# Altium schematic sheet Sheet1.SchDoc
size 594 x 420 mm; Address1: Address1; Address2: Address2; Address3: Address3; Address4: Address4; DocumentNumber: АБВГ.123456.001 Э3; SheetNumber: 1; Scale: 1:1; DocumentType: Схема электрическая принципиальная; FirstReferrence: АБВГ.123456.001
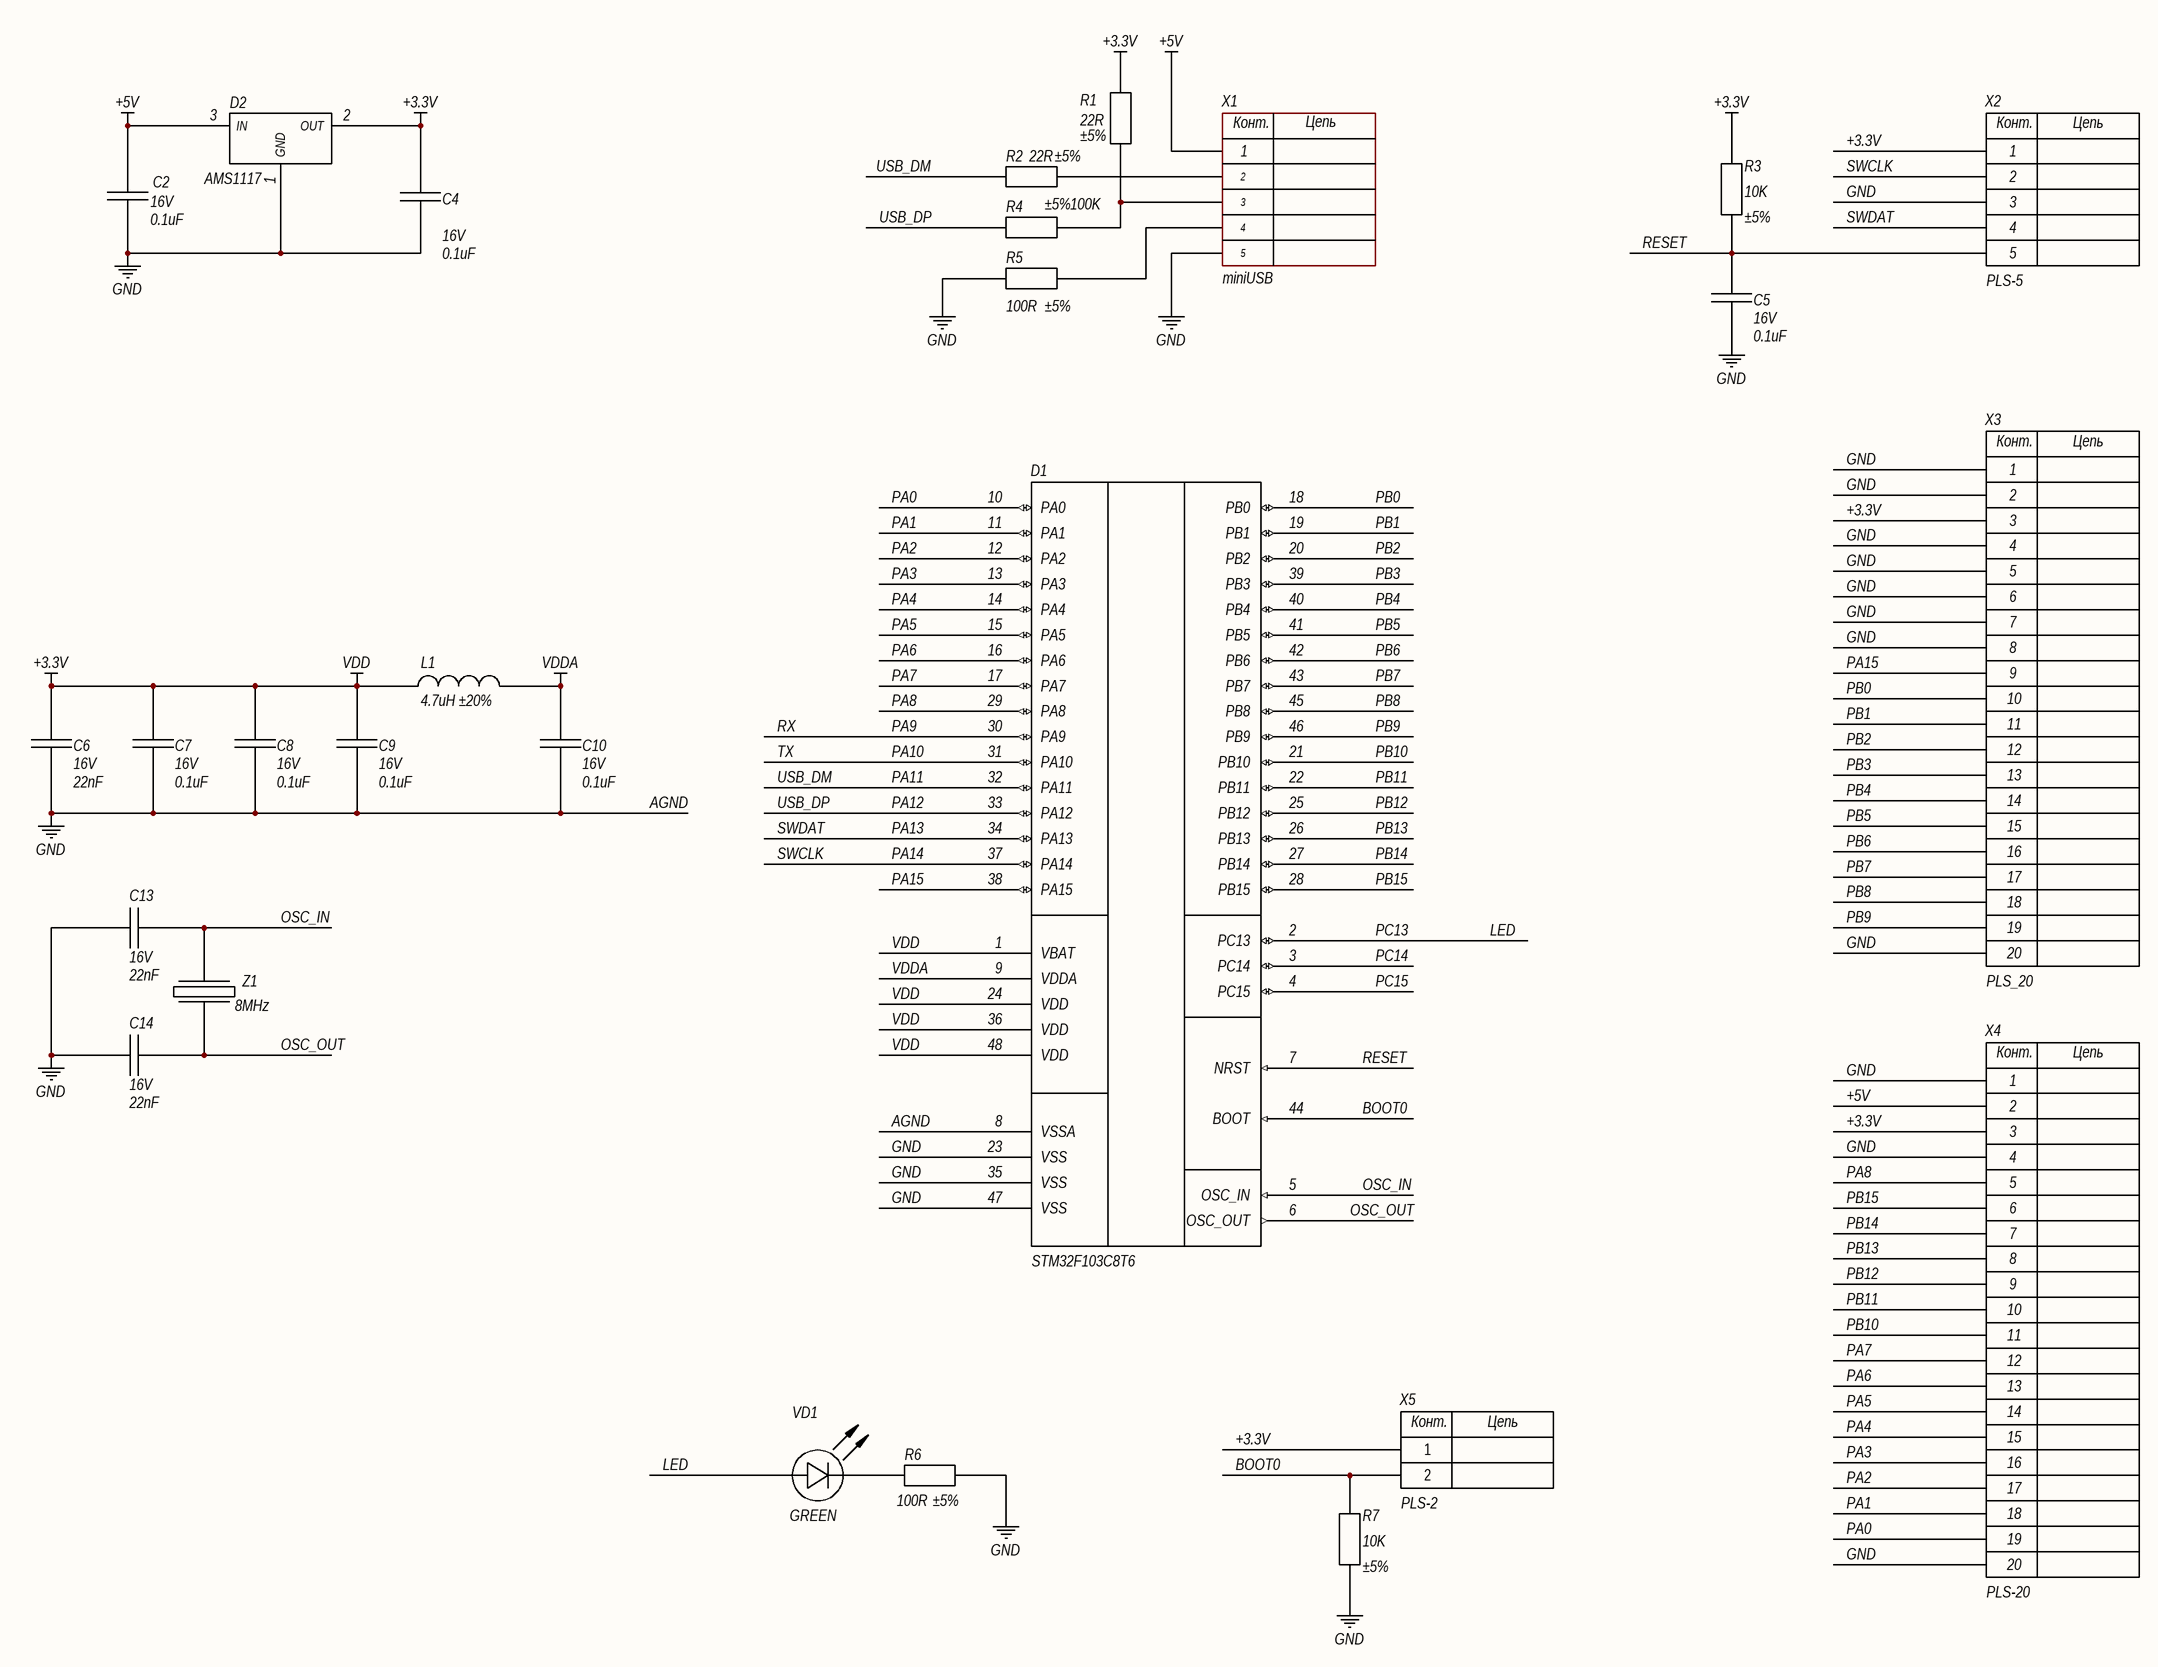
[diagram p0: Sheet1.SchDoc]

## Parts
C2  value 0.1uF  Voltage: 16V  [CAP: 0805]
C4  value 0.1uF  Voltage: 16V  [CAP: 0805]
C5  value 0.1uF  Voltage: 16V  [CAP: 0805]
C6  value 22nF  Voltage: 16V  [CAP: 0805]
C7  value 0.1uF  Voltage: 16V  [CAP: 0805]
C8  value 0.1uF  Voltage: 16V  [CAP: 0805]
C9  value 0.1uF  Voltage: 16V  [CAP: 0805]
C10  value 0.1uF  Voltage: 16V  [CAP: 0805]
C13  value 22nF  Voltage: 16V  [CAP: 0805]
C14  value 22nF  Voltage: 16V  [CAP: 0805]
D1  (no value)  [48-LQFP]
D2  AMS1117  [PCBComponent_1]
L1  value 4.7uH  Tolerance: ±20%  [IND: 0805]
R1  value 22R  Tolerance: ±5%  [RES: 0805]
R2  value 22R  Tolerance: ±5%  [RES: 0805]
R3  value 10K  Tolerance: ±5%  [RES: 0805]
R4  value 100R  Tolerance: ±5%  [RES: 0805]
R5  value 100K  Tolerance: ±5%  [RES: 0805]
R6  value 100R  Tolerance: ±5%  [RES: 0805]
R7  value 10K  Tolerance: ±5%  [RES: 0805]
VD1  Color: GREEN  [LED: 0402B]
X1  CommentText: miniUSB  [CON: 0675031020]
X2  (no value)  [CON: PLS-5]
X3  CommentText: PLS_20  [CON: PLS-20]
X4  (no value)  [CON: PLS-20]
X5  (no value)  [CON: PLS-2]
Z1  Frequency: 8MHz  [OSC: 3215]

## Nets
+3.3V: C4.2 C6.2 C7.2 C8.2 C9.2 D1.1(VBAT) D1.24(VDD) D1.36(VDD) D1.48(VDD) D2.2(OUT) L1.2 R1.1 R3.2 X2.1 X3.3 X4.3 X5.1  [also labelled VDD]
+5V: C2.2 D2.3(IN) X1.1 X4.2
AGND: C2.1 C4.1 C5.1 C6.1 C7.1 C8.1 C9.1 C10.1 C13.2 C14.1 D1.8(VSSA) D1.23(VSS) D1.35(VSS) D1.47(VSS) D2.1(GND) R5.1 R6.2 R7.1 X1.5 X2.3 X3.1 X3.2 X3.4 X3.5 X3.6 X3.7 X3.8 X3.20 X4.1 X4.4 X4.20  [also labelled GND]
VDDA: C10.2 D1.9(VDDA) L1.1
BOOT0: D1.44(BOOT) R7.2 X5.2
LED: D1.2(PC13) VD1.1(A)  [also labelled PC13]
OSC_IN: C13.1 D1.5(OSC_IN) Z1.2
OSC_OUT: C14.2 D1.6(OSC_OUT) Z1.1
PA0: D1.10(PA0) X4.19
PA1: D1.11(PA1) X4.18
PA2: D1.12(PA2) X4.17
PA3: D1.13(PA3) X4.16
PA4: D1.14(PA4) X4.15
PA5: D1.15(PA5) X4.14
PA6: D1.16(PA6) X4.13
PA7: D1.17(PA7) X4.12
PA8: D1.29(PA8) X4.5
PA9: D1.30(PA9)  [also labelled RX]
PA10: D1.31(PA10)  [also labelled TX]
PA11: D1.32(PA11) R2.1  [also labelled USB_DM]
PA12: D1.33(PA12) R4.1  [also labelled USB_DP]
PA13: D1.34(PA13) X2.4  [also labelled SWDAT]
PA14: D1.37(PA14) X2.2  [also labelled SWCLK]
PA15: D1.38(PA15) X3.9
PB0: D1.18(PB0) X3.10
PB1: D1.19(PB1) X3.11
PB2: D1.20(PB2) X3.12
PB3: D1.39(PB3) X3.13
PB4: D1.40(PB4) X3.14
PB5: D1.41(PB5) X3.15
PB6: D1.42(PB6) X3.16
PB7: D1.43(PB7) X3.17
PB8: D1.45(PB8) X3.18
PB9: D1.46(PB9) X3.19
PB10: D1.21(PB10) X4.11
PB11: D1.22(PB11) X4.10
PB12: D1.25(PB12) X4.9
PB13: D1.26(PB13) X4.8
PB14: D1.27(PB14) X4.7
PB15: D1.28(PB15) X4.6
PC14: D1.3(PC14)
PC15: D1.4(PC15)
RESET: C5.2 D1.7(NRST) R3.1 X2.5
NetR1_2: R1.2 R4.2 X1.3
NetR2_2: R2.2 X1.2
NetR5_2: R5.2 X1.4
NetR6_1: R6.1 VD1.2(C)

## Notes on the sheet
- Перв. примен.
- Справ. №
- Подп. и дата
- Инв. № дубл.
- Взам. инв. №
- Разраб.
- Изм.
- Лист
- № докум.
- Подп.
- Дата
- Лит.
- Масса
- Масштаб
- Пров.
- Т.контр.
- Листов
- Инв. № подл.
- Утв.
- Н.контр.
- 2.106-A2
- Копировал
- Формат А2
- (in symbol Connector_USB_mini_B) Конт.; Цепь
- (in symbol PLS-2) Конт.; Цепь
- (in symbol PLS-5) Конт.; Цепь
- (in symbol PLS-20) Конт.; Цепь

## Library data of the parts
C2 C4 C5 C7-C10 = Ceramic_0805: Manufacturer: Yageo; PartNumber: CC0805KRX7R7BB104; ValueManufacturerPartNumber: Ceramic capacitor, 0.1uF, X7R, ±10%, 16V, 0805, -55...+125°C; TypeCapacitor: Ceramic capacitor; Tolerance: ±10%; TypeDielectric: X7R; Package: 0805; HelpURL: https://www.digikey.com/product-detail/en/yageo/CC0805KRX7R7BB104/311-1142-1-ND/303052; Temperature: -55...+125°C
C6 C13 C14 = Ceramic_0805: Manufacturer: Yageo; PartNumber: CC0805KRX7R7BB104; ValueManufacturerPartNumber: Ceramic capacitor, 22nF, X7R, ±10%, 16V, 0805, -55...+125°C; TypeCapacitor: Ceramic capacitor; Tolerance: ±10%; TypeDielectric: X7R; Package: 0805; HelpURL: https://www.digikey.com/product-detail/en/yageo/CC0805KRX7R7BB104/311-1142-1-ND/303052; Temperature: -55...+125°C
D1 = STM32F103C8T6: Cortex-M3; Manufacturer: STMicroelectronics; ValueManufacturerPartNumber: IC microcontroller, 32-Bit, Cortex-M3, 72MHz, 64KB, 20KB, 2...3.6V, -40...+85°C, 48-LQFP; Supply: 2...3.6V; Speed: 72MHz; CoreSize: 32-Bit; MemoryROM: 64KB; MemoryRAM: 20KB; HelpURL: https://www.digikey.com/product-detail/en/stmicroelectronics/STM32F103C8T6TR/497-17666-1-ND/7804402; Package: 48-LQFP; ComponentType: IC microcontroller; Temperature: -40...+85°C; CoreProcessor: Cortex-M3; PartNumber: STM32F103C8T6
L1 = Inductor_0805: Manufacturer: Murata Electronics; PartNumber: LQM21FN100M70L; ValueManufacturerPartNumber: Fixed inductor, 4.7uH, ±20%, 0805, 100mA, -55...+125°C; TypeInductor: Fixed inductor; MaxCurrent: 100mA; Package: 0805; HelpURL: https://www.digikey.com/product-detail/en/murata-electronics-north-america/LQM21FN100M70L/490-4029-1-ND/1016289; Temperature: -55...+125°C
R1 R2 = Resistor_0805: Manufacturer: Yageo; PartNumber: RC0805JR-07100RL; ValueManufacturerPartNumber: Resistor film, 22R, ±5%, 0805, 0.125W, -55...+125°C; TypeResistor: Resistor film; Power: 0.125W; Package: 0805; HelpURL: https://www.digikey.com/product-detail/en/yageo/RC0805JR-07100RL/311-100ARCT-ND/731185; Temperature: -55...+125°C
R3 R7 = Resistor_0805: Manufacturer: Yageo; PartNumber: RC0805JR-07100RL; ValueManufacturerPartNumber: Resistor film, 10K, ±5%, 0805, 0.125W, -55...+125°C; TypeResistor: Resistor film; Power: 0.125W; Package: 0805; HelpURL: https://www.digikey.com/product-detail/en/yageo/RC0805JR-07100RL/311-100ARCT-ND/731185; Temperature: -55...+125°C
R4 R6 = Resistor_0805: Manufacturer: Yageo; PartNumber: RC0805JR-07100RL; ValueManufacturerPartNumber: Resistor film, 100R, ±5%, 0805, 0.125W, -55...+125°C; TypeResistor: Resistor film; Power: 0.125W; Package: 0805; HelpURL: https://www.digikey.com/product-detail/en/yageo/RC0805JR-07100RL/311-100ARCT-ND/731185; Temperature: -55...+125°C
R5 = Resistor_0805: Manufacturer: Yageo; PartNumber: RC0805JR-07100RL; ValueManufacturerPartNumber: Resistor film, 100K, ±5%, 0805, 0.125W, -55...+125°C; TypeResistor: Resistor film; Power: 0.125W; Package: 0805; HelpURL: https://www.digikey.com/product-detail/en/yageo/RC0805JR-07100RL/311-100ARCT-ND/731185; Temperature: -55...+125°C
VD1 = LED_single: ValueManufacturerPartNumber: LED, Green, *, *, *, -55...+150°C; TypeDiode: LED; Manufacturer: *; Package: *; HelpURL: *; Temperature: -55...+150°C; Current: *; VoltageDrop: *; PartNumber: *; ColorParameter: Green
X1 = Connector_USB_mini_B: Manufacturer: Molex; ValueManufacturerPartNumber: USB mini B; PartNumber: 0675031020; HelpURL: https://www.digikey.com/product-detail/en/molex/0675031020/WM5461CT-ND/1624427; TypeConnector: USB mini B
X2 = PLS-5: Manufacturer: Connfly; ValueManufacturerPartNumber: Connector, 5pin, 2.54mm, 500VAC, 3A; TypeConnector: Connector; VoltageMax: 500VAC; Pitch: 2.54mm; CurrentMax: 3A; Multichannel: 5pin; HelpURL: https://www.chipdip.ru/product/pls-5; PartNumber: PLS-5; CommentText: PLS-5
X3 X4 = PLS-20: Manufacturer: Connfly; ValueManufacturerPartNumber: Connector, 20pin, 2.54mm, 500VAC, 3A; TypeConnector: Connector; VoltageMax: 500VAC; Pitch: 2.54mm; CurrentMax: 3A; Multichannel: 20pin; HelpURL: https://www.chipdip.ru/product/pls-20; PartNumber: PLS-20
  X4: CommentText: PLS-20
X5 = PLS-2: Manufacturer: Connfly; ValueManufacturerPartNumber: Connector, 2pin, 2.54mm, 500VAC, 3A; TypeConnector: Connector; VoltageMax: 500VAC; Pitch: 2.54mm; CurrentMax: 3A; Multichannel: 2pin; HelpURL: https://www.chipdip.ru/product/pls-2; PartNumber: PLS-2; CommentText: PLS-2
Z1 = Crystal_3215: Manufacturer: Epson; PartNumber: FC-135 32.7680KA-A5; ValueManufacturerPartNumber: Crystal, 8MHz, 12.5pF, ±20ppm, case 3215, -40...+85°C; LoadCapacitance: 12.5pF; Tolerance: ±20ppm; Package: case 3215; HelpURL: https://www.digikey.com/product-detail/en/epson/FC-135-32.7680KA-A5/SER4103CT-ND/6188447; Temperature: -40...+85°C; TypeOscilator: Crystal